# Altium schematic sheet Power.SchDoc
size A4; SheetNumber: 4; SheetTotal: 6
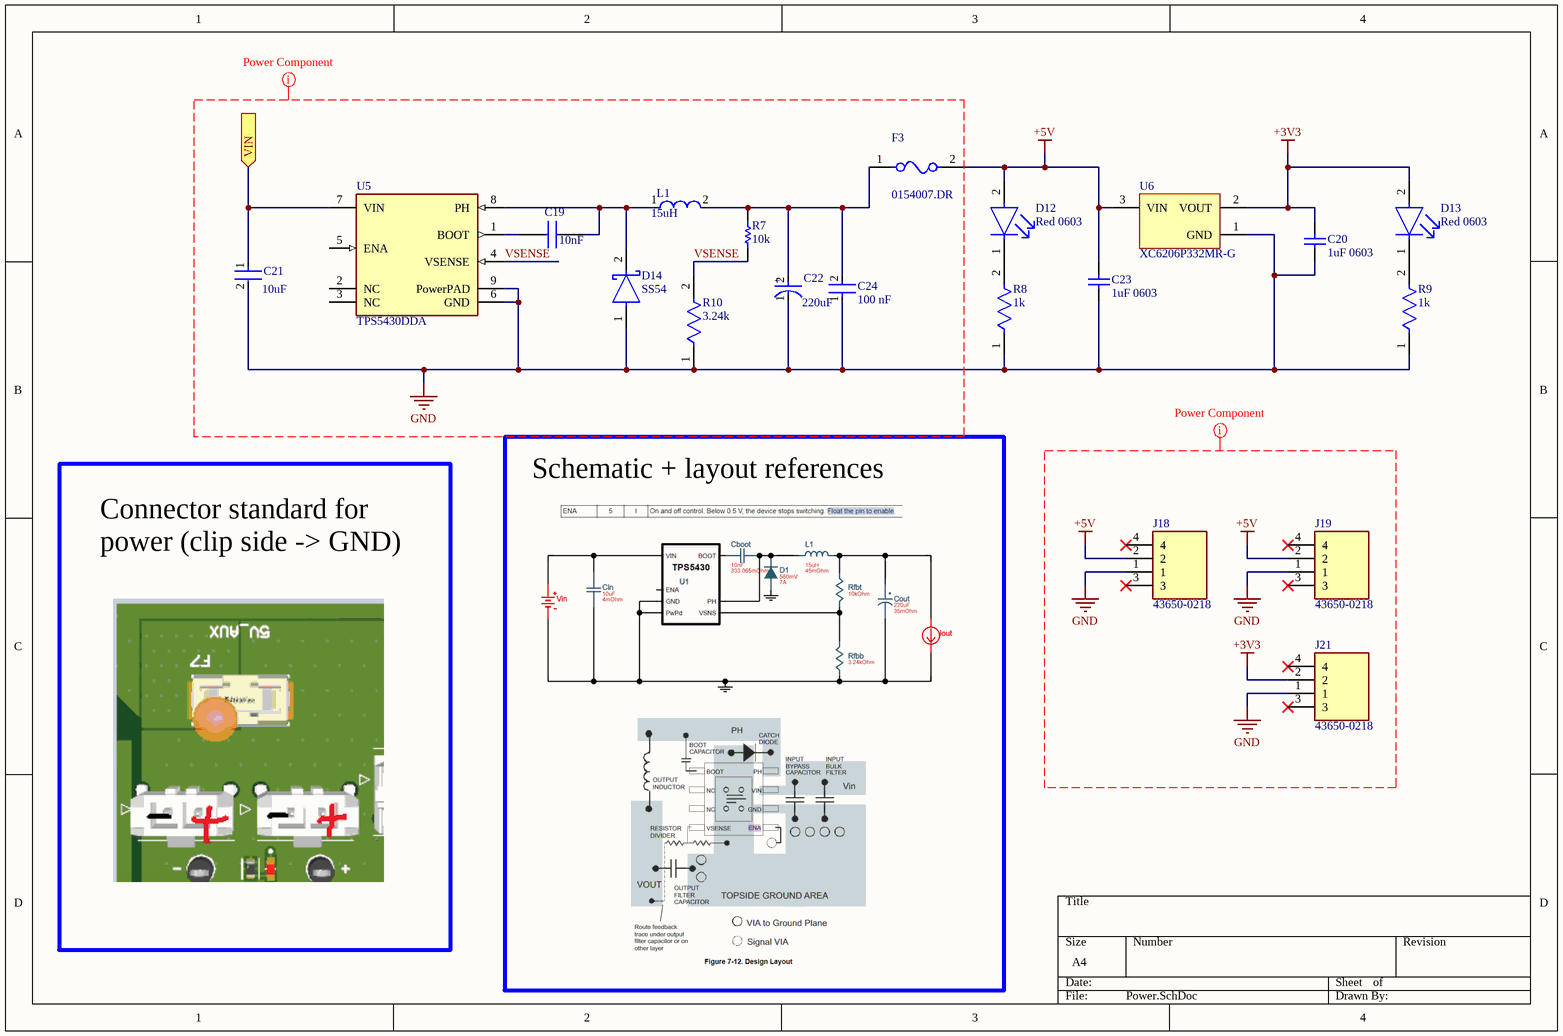
[diagram p0: Power.SchDoc]

## Parts
C19  Capacitance: 10nF  [CAPC1608X95N]  (hidden comment: 10nF 0603)
C20  1uF 0603  [CAPC1608X95N]
C21  Capacitance: 10uF  [FP-GRM21B-0_2-e0_2_0_7-IPC_A]  (hidden comment: GRM21BR61H106KE43L)
C22  Capacitance: 220uF  [FP-POSCAP-B2-MFG]  (hidden comment: 6TPE220MAZB)
C23  1uF 0603  [CAPC1608X95N]
C24  Capacitance: 100 nF  [FP-CC0603-DA-MFG]  (hidden comment: CC0603KRX7R9BB104)
D12  Red 0603  [FP-150060RS55040-MFG]
D13  Red 0603  [FP-150060RS55040-MFG]
D14  SS54  [FP-403AE-MFG]
F3  0154007.DR  [FP-0154-MFG]
J18  43650-0218  [43650-02YY_18192063]
J19  43650-0218  [43650-02YY_18192063]
J21  43650-0218  [43650-02YY_18192063]
L1  Inductance: 15uH  [FP-SPM10040-MFG]  (hidden comment: MWSA1004S-150MT)
R7  Resistance: 10k  [RESC1609X50X30NL8T20]  (hidden comment: 0603WAF1002T5E)
R8  1k  [FP-RC0603-0_55-IPC_C]
R9  1k  [FP-RC0603-0_55-IPC_C]
R10  Resistance: 3.24k  [FP-CRCW0603-e3-IPC_A]  (hidden comment: 0603WAF3241T5E)
U5  TPS5430DDA  [FP-DDA0008J-MFG]
U6  XC6206P332MR-G  [SOT-23-TT3_N]

## Ports
VIN (in, see Actuation[7A], Drivers[3A])

## Nets
+3V3: C20.2 D13.2(A) J21.2 U6.2(VOUT)
+5V: C23.2 D12.2(A) F3.2 J18.2 J19.2 U6.3(VIN)
GND: C20.1 C21.2 C22.1(C) C23.1 C24.1 D14.1(A) J18.1 J19.1 J21.1 R8.1 R9.1 R10.1 U5.6(GND) U5.9(PowerPAD) U6.1(GND)
VIN: C21.1 U5.7(VIN) ; port VIN
VSENSE: R7.1 R10.2 U5.4(VSENSE)
NetC19_1: C19.1 U5.1(BOOT)
NetC19_2: C19.2 D14.2(C) L1.1 U5.8(PH)
NetC22_2: C22.2(A) C24.2 F3.1 L1.2 R7.2
NetD12_1: D12.1(C) R8.2
NetD13_1: D13.1(C) R9.2

Not connected (* = marked no-connect by the designer): J18 3* 4*; J19 3* 4*; J21 3* 4*; U5 2(NC) 3(NC) 5(ENA)

## Layout directives
CompClassName: Power Component: +3V3, +5V, GND, VSENSE

## Notes on the sheet
- Schematic + layout references
- Connector standard for power (clip side -> GND)
- (in symbol CMP-05429-000001-2) +

## Library data of the parts
C19 = CMP-123-000015-1: 50V 10nF X7R ±10% 0603 Multilayer Ceramic Capacitors MLCC - SMD/SMT ROHS; Manufacturer_Part_Number: 0603B103K500NT; Manufacturer_Name: FH (Guangdong Fenghua Advanced Tech); Datasheet Link: https://wmsc.lcsc.com/wmsc/upload/file/pdf/v2/lcsc/2304140030_FH--Guangdong-Fenghua-Advanced-Tech-0603B103K500NT_C57112.pdf
C20 C23 = CMP-00099-1: 1uF 0603, Ceramic Capacitor, Multilayer, Ceramic, 50V, 10% +Tol, 10% -Tol, X5R, 15% TC, 1uF, Surface Mount, 0603; Multilayer: Yes; Capacitor Type: Ceramic; Height: 0.9mm; Package Shape: Rectangular; JESD-609 Code: e3; Value: 1uF; Terminal Finish: Nickel; Length: 1.6mm; Package Style: SMTMeter; RoHS Compliant: Yes; Mounting Technology: Surface Mount; Case/Package: 0603; Rated DC Voltage (URdc): 50V; Pins: 2; Min Operating Temperature: -55°C; Max Operating Temperature: 85°C; Dielectric Material: Ceramic; Width: 0.8mm; Termination: Wraparound; Packaging: Tape and Reel; Tolerance (fill in as +-): 10%; Tolerance  (fill in as +-): 10%; Reach SVHC Compliant: Yes; Temperature Characteristics Code: X5R
C21 = CMP-06035-004402-1: Chip Multilayer Ceramic Capacitors for General Purpose, 0805, 10uF, X5R, 15%, 10%, 50V; Voltage Rating (DC): 50V; Dielectric: X5R; Tolerance: 10%; Thickness: 1.25mm; Length: 2mm; Width: 1.25mm
C22 = CMP-05429-000001-2: Molded Tantalum Polymer Capacitor 220uF 20% 6.3V life 1000Hours SMD 1411; ESR (Equivalent Series Resistance): 35mR; Ripple Current: 1.4A; Leakage Current: 138.6uA; Polarity: Polar; Dissipation Factor: 10%; Construction: Flat; Case/Package: Molded; Min Operating Temperature: -55°C; Voltage Rating (DC): 6.3V; Voltage: 6.3V; Termination: SMD/SMT; Voltage Rating: 6.3V; Mount: Surface Mount; Features: General Purpose; Height - Seated (Max): 0.079inch; Case Code (Imperial): 1210; REACH SVHC: No SVHC; Packaging: Tape and Reel; Lead Free: Lead Free; Width: 2.8mm; Height: 1.9mm; Series: POSCAP™ TPE; Tolerance: 20%; Case Code (Metric): 3528; RoHS Compliant: Yes; Max Operating Temperature: 105°C; Number of Pins: 2; Radiation Hardening: No; Depth: 2.8mm; Package Quantity: 1; Length: 3.5mm
C24 = CMP-2100-03601-2: CAP CER 0.1UF 50V X7R 0603; Manufacturer: YAGEO; Material: Ceramic; Temperature Coefficient: 15%; Tolerance: 0.1; Value: 100 nF; Height: 0.9mm; Voltage: 50 V; ComponentLink2Description: Datasheet; Device Class L2: Capacitors; Temperature Range High: +125°C; Category: Cap; Footprint Url: http://www.yageo.com/exep/pages/download/literatures/UPY-C_GEN_24.pdf; ComponentLink2URL: http://www.yageo.com/documents/recent/UPY-GPHC_X7R_6.3V-to-50V_18.pdf; Package: CC0603-DA; Temperature: -55°C to +125°C; Voltage Rating: 50 V; Temperature Characteristic: X7R; Device Class L1: Passive Components; Temperature Range Low: -55°C; Manufacturer Part Number: CC0603KRX7R9BB104; RoHS: TRUE; Automotive: No; Device Class L3: Ceramic Capacitors; Octopart: https://octopart.com/cc0603krx7r9bb104-yageo-42244635; Mouser Description: Multilayer Ceramic Capacitor, CC Series, 0.1 - F, - 10%, X7R, 50 V, 0603 [1608 Metric]; Lead Free: Yes; Digikey Description: CAP CER 0.1UF 50V X7R 0603
D12 D13 = CMP-00010-2: Led Red Diffused 0603 SMD; Manufacturer Part No.: 150060RS55040; Lens Style: Flat; Luminous Intensity: 90mcd; Lens Size: 0.8mm; Dominant Wavelength: 624nm; Viewing Angle: 140°; Test Current: 20mA; Forward Voltage: 2V; Case Code (Metric): 1608; Lens Transparency: Diffused; Packaging: Cut Tape; Datasheet: https://www.farnell.com/datasheets/2621644.pdf?src-supplier=Farnell; Case/Package: 0603; Mounting Technology: Surface Mount; Height: 0.5mm; Length: 1.6mm; RoHS Compliant: Yes; Width: 0.8mm; Series: WL-SMDC; Case Code (Imperial): 0603; Color: Red
D14 = CMP-2000-04943-2: DIODE SCHOTTKY 40V 5A SMA; Standoff Height: 0.05mm; Manufacturer Part Number: SS54; Device Class L3: Schottky Diodes; Category: Diode; Automotive: No; Device Class L2: Diodes; Height: 2.5mm; Temperature Range High: +125°C; Device Class L1: Discrete Semiconductors; Package: 403AE; Temperature Range Low: -65°C; Temperature: -65°C to +125°C
F3 = CMP-08605-000035-1: FUSE BRD MNT 7A 125VAC/VDC 2SMD; Manufacturer: Littelfuse Inc; Max Fuse Ac Voltage: 125V; Fuse Blow Speed: Fast; Manufacturer Part Number: 0154007.DR; Device Class L1: Circuit Protection; Octopart: https://octopart.com/0154007.dr-littelfuse-565863; RoHS: TRUE; Automotive: No; Category: Fuse; Device Class L3: unset; Fuse Current: 7A; Device Class L2: Fuses; Height: 3.81mm; Temperature: -55°C to +125°C; ComponentLink2URL: https://www.littelfuse.com/~/media/electronics/datasheets/fuses/littelfuse_fuse_154_154t_154l_154tl_datasheet.pdf.pdf; Digikey Description: FUSE BRD MNT 7A 125VAC/VDC 2SMD; Package: 0154; Max Fuse Dc Voltage: 125V; Temperature Range High: +125°C; Lead Free: Yes; ComponentLink2Description: Datasheet; Mouser Description: Surface Mount Fuses Fuseblock w/ fuse 7A OMNI BLOK 154; Temperature Range Low: -55°C
J18 J19 J21 = 43650-0218: Connector; Manufacturer_Name: Molex; Datasheet Link: https://www.molex.com/pdm_docs/sd/436500218_sd.pdf; Height: 9.9mm; Manufacturer_Part_Number: 43650-0218; Mouser Part Number: 538-43650-0218; Mouser Price/Stock: https://www.mouser.co.uk/ProductDetail/Molex/43650-0218?qs=z57USrEQgt0ffE4b1Ju68Q%3D%3D
L1 = CMP-08253-000004-1: 6.5A 15uH ±20% 7A SMD,11x10mm Power Inductors ROHS; Category: Ind; Device Class L1: Passive Components; Device Class L2: Inductors; Device Class L3: Fixed Inductors; Height: 4mm; Manufacturer Part Number: MWSA1004S-150MT; Value: 15uH
R7 = CMP-1666-00005-4: 100mW Thick Film Resistors 75V ±100ppm/℃ ±1% 10kΩ 0603 Chip Resistor - Surface Mount ROHS; Max Operating Temperature: 155 degC; Voltage Rating: 75 V; PackageDescription: 2-Pin Surface Mount Device, Body 1.575 x 0.85 mm; ComponentLink1Description: Manufacturer URL; RoHSCompliant: true; PackageReference: 0603; REACH SVHC: Unknown; Length: 1.55 mm; Packaging: Tape and Reel; Min Operating Temperature: -55 degC; Mounting Technology: Surface Mount; ComponentLink2URL: https://datasheet.ciiva.com/11809/0900766b80d98afc-11809037.pdf; Height: 0.45 mm; ComponentLink2Description: Datasheet; Package Quantity: 5000; ComponentLink1URL: http://www.vishay.com/
R8 R9 = CMP-1659-00009-5: RC0603FR-071KL. RES 1K OHM 1% 1/10W 0603; Resistance: 1kR; Voltage Rating: 50V; Power Rating: 100mW; Temperature Coefficient: 100ppm/°C; Military Standard: Not; REACH SVHC: No SVHC; Size Code: 0603; Features: Moisture Resistant; Number of Terminations: 2; Technology: THICK FILM; Series: RC; Case Code (Metric): 1608; Resistance Tolerance: 1%; Resistor Type: Thick Film; Termination: SMD/SMT; Contact Plating: Tin; Radiation Hardening: No; Min Operating Temperature: -55°C; Max Operating Temperature: 155°C; Packaging: Tape and Reel; Max Power Dissipation: 100mW; RoHS Compliant: Yes; Height: 0.45mm; Lead Free: Lead Free; Case/Package: 0603; Length: 1.6mm; Tolerance: 1%; Case Code (Imperial): 0603; Construction: Rectangular; Depth: 0.8mm
R10 = CMP-2000-03299-2: 100mW Thick Film Resistors 75V ±100ppm/℃ ±1% 3.24kΩ 0603 Chip Resistor - Surface Mount ROHS; Temperature Coefficient: 100ppm/°C; Depth: 0.85mm; Case/Package: 0603; Number of Terminations: 2; Case Code (Imperial): 0603; Width: 0.85mm; Number of Pins: 2; Termination: SMD/SMT; Power Rating: 100mW; Length: 1.55mm; Case Code (Metric): 1608; Composition: Thick Film; Height: 0.45mm; Max Power Dissipation: 100mW; Mount: Surface Mount
U5 = CMP-2000-04960-2: IC REG BUCK ADJUSTABLE 3A 8SOPWR; Manufacturer: Texas Instruments; Max Junction Temp: +125°C; Max Supply Voltage: 36V; Switching Frequency: 500kHz; Output Type: AdjustableProgrammable; Standoff Height: 0mm; Output Voltage: 1.23-31V; Max Duty Cycle: 89%; Nominal Supply Current: 3mA; Min Supply Voltage: 5.5V; Number Of Outputs: 1; Temperature: -40°C to +125°C; Temperature Range High: +125°C; Manufacturer Part Number: TPS5430DDA; Device Class L3: Voltage Regulators - Switching; Mouser Description: Voltage Regulators - Switching Regulators 5.5 to 36V Input 3A Step Dwn Converter; Switching Topology: Buck; ComponentLink2URL: http://www.ti.com/lit/ds/symlink/tps5431.pdf; ComponentLink2Description: Datasheet; Device Class L2: Power Management ICs; Device Class L1: Integrated Circuits (ICs); Digikey Description: IC REG BUCK ADJUSTABLE 3A 8SOPWR; RoHS: TRUE; Octopart: https://octopart.com/tps5430dda-texas+instruments-589977; Output Current: 3A; Automotive: No; Lead Free: Yes; Category: IC; Package: DDA0008J; Temperature Range Low: -40°C; Height: 1.7mm
U6 = CMP-0136-00791-1: 200mA Fixed 3.3V Positive electrode 6V SOT-23-3L Linear Voltage Regulators (LDO) ROHS; Code_IPC: SOT23-3; PackageReference: SOT-23-TT3; PackageDescription: 3-Lead Plastic Small Outline Transistor (TT) [SOT-23]